# Altium project PCB_Project.PrjPcb
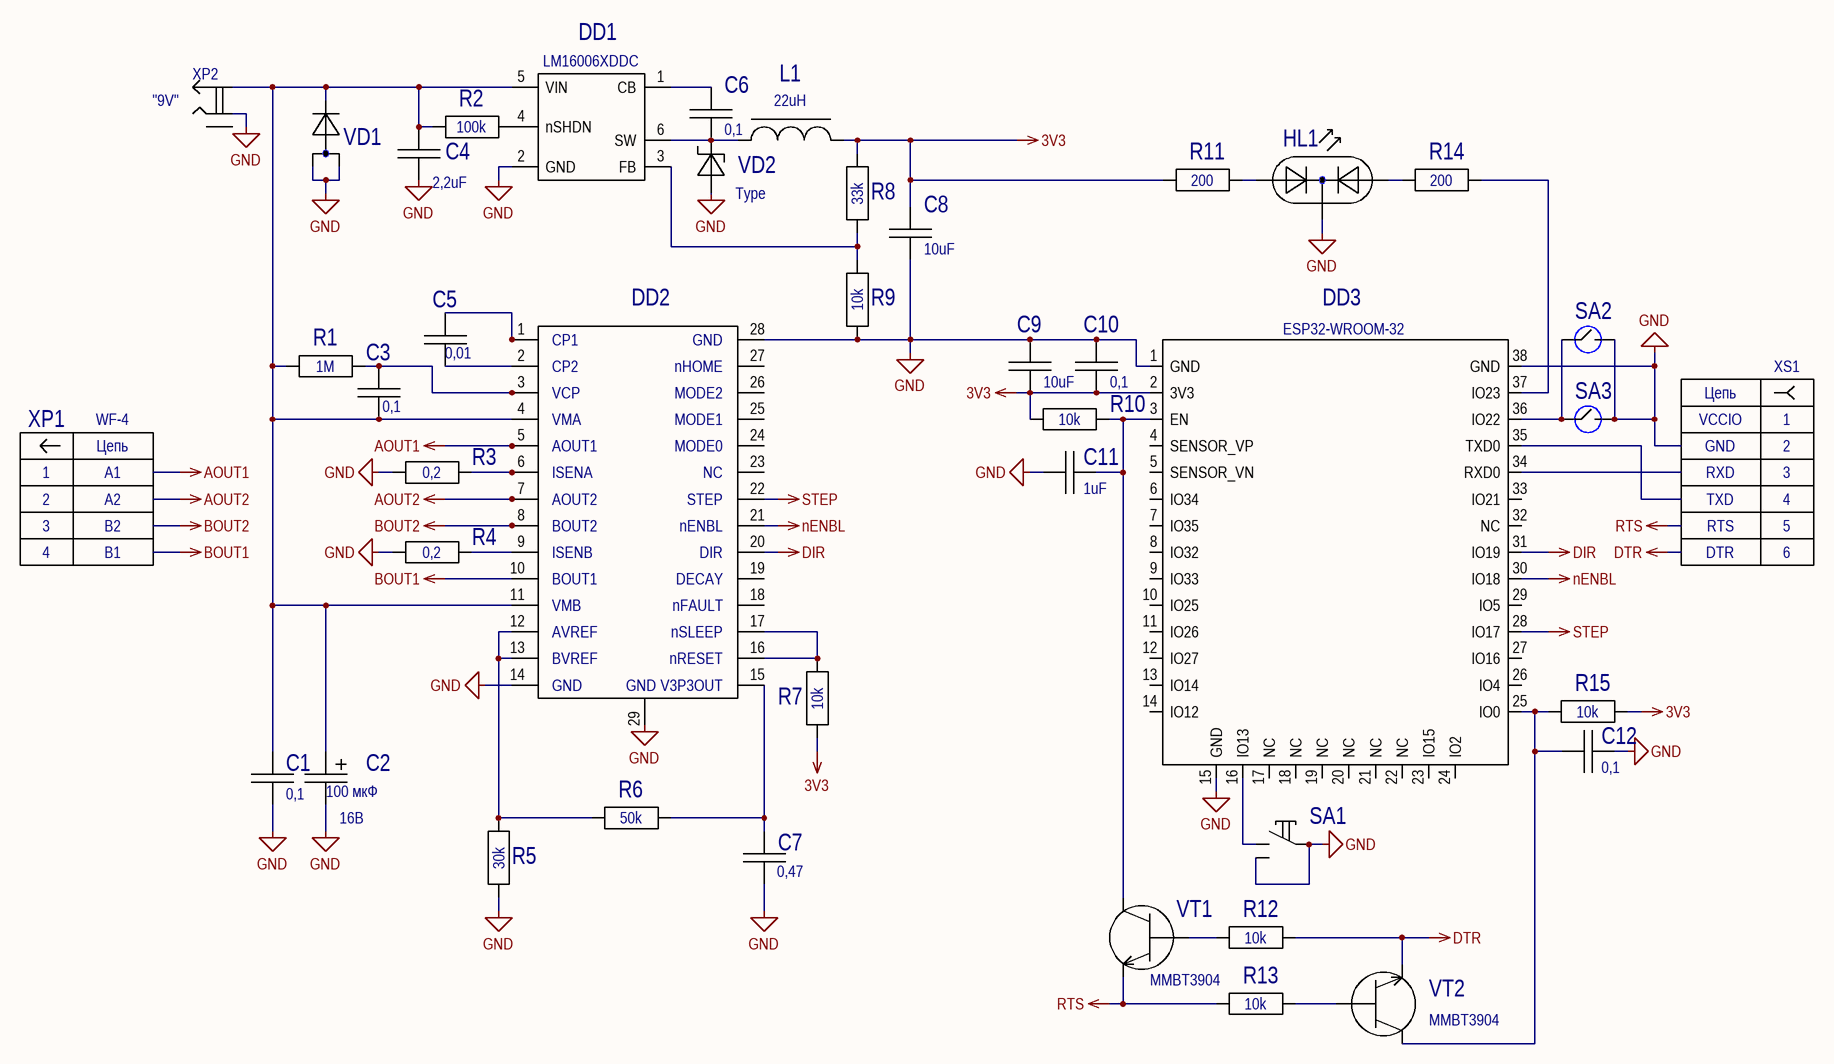
[diagram p0: Схема.SchDoc]
1 sheet, 42 parts. Net scope: global (net labels, ports and power ports of the same name join across sheets).
Board file: PCB.PcbDoc

## Sheet Схема.SchDoc: Индекс
size 419 x 296 mm; ApprovedBy: Утвердил; CheckedBy: Проверил; Author: Разработал; DrawnBy: Нормоконтроль; Engineer: Технолог; Address1: строка 1; Address2: строка 2; Address3: строка 3; Address4: строка 4; SheetNumber: 1; SheetTotal: 1

### Parts
C1  value 0,1  [CAPC1608X09N]  (hidden comment: C0603)
C2  value 100 мкФ  Volt: 16В  [K53-68-E]  (hidden comment: К53-68-E)
C3  value 0,1  [CAPC1608X09N]  (hidden comment: C0603)
C4  value 2,2uF  [CAPC2012X14N]  (hidden comment: C0805)
C5  value 0,01  [CAPC1608X09N]  (hidden comment: C0603)
C6  value 0,1  [CAPC1608X09N]  (hidden comment: C0603)
C7  value 0,47  [CAPC1608X09N]  (hidden comment: C0603)
C8  value 10uF  [CAPC2012X14N]  (hidden comment: C0805)
C9  value 10uF  [CAPC2012X14N]  (hidden comment: C0805)
C10  value 0,1  [CAPC1608X09N]  (hidden comment: C0603)
C11  value 1uF  [CAPC1608X09N]  (hidden comment: C0603)
C12  value 0,1  [CAPC1608X09N]  (hidden comment: C0603)
DD1  LM16006  [TSOP95P280X110-6N]  (value not drawn)
DD2  DRV8825  [TSOP65P640X120_HS-29N]  (value not drawn)
DD3  Твердотельное реле 90В, 10А  [ESP32]  (value not drawn)
HL1  LED3mm3pinCommonCatode  [LED3mm3pinCommonCatode]  (value not drawn)
L1  value 22uH  [INDP7373X45N]  (hidden comment: B82472G6223M000)
R1  value 1M  [RESC1608X06N]  (hidden comment: R0603)
R2  value 100k  [RESC1608X06N]  (hidden comment: R0603)
R3  value 0,2  [RESC2012X07N]  (hidden comment: CRL2512-FWR200ELF)
R4  value 0,2  [RESC2012X07N]  (hidden comment: CRL2512-FWR200ELF)
R5  value 30k  [RESC1608X06N]  (hidden comment: R0603)
R6  value 50k  [RESC1608X06N]  (hidden comment: R0603)
R7  value 10k  [RESC1608X06N]  (hidden comment: R0603)
R8  value 33k  [RESC1608X06N]  (hidden comment: R0603)
R9  value 10k  [RESC1608X06N]  (hidden comment: R0603)
R10  value 10k  [RESC1608X06N]  (hidden comment: R0603)
R11  value 200  [RESC1608X06N]  (hidden comment: R0603)
R12  value 10k  [RESC1608X06N]  (hidden comment: R0603)
R13  value 10k  [RESC1608X06N]  (hidden comment: R0603)
R14  value 200  [RESC1608X06N]  (hidden comment: R0603)
R15  value 10k  [RESC1608X06N]  (hidden comment: R0603)
SA1  Кнопка  [Кнопка 4,3х4,3 боковая]  (value not drawn)
SA2  геркон 12мм  [Геркон 12 мм]  (value not drawn)
SA3  геркон 12мм  [Геркон 12 мм]  (value not drawn)
VD1  SS10PH10  [TO-277A]  (value not drawn)
VD2  Диод Шоттки 40V, 500mA SOD123  [SODFL370X125-2N]  (value not drawn)
VT1  MMBT3904  [SOT95P245X110-3N]
VT2  MMBT3904  [SOT95P245X110-3N]
XP1  WF4  [WF-4]  (value not drawn)
XP2  DC-005  [DC-005]  (value not drawn)
XS1  PBS-6R  [PBS-6]  (value not drawn)

### Nets
3V3: C8.1 C9.2 C10.1 DD3.2(3V3) L1.1 R7.1 R8.2 R10.2 R11.2 R15.1
AOUT1: DD2.5 XP1.1
AOUT2: DD2.7 XP1.2
BOUT1: DD2.10 XP1.4
BOUT2: DD2.8 XP1.3
DIR: DD2.20 DD3.31(IO19)
DTR: R12.2 VT2.2(E) XS1.6
GND: C1.1 C2.2 C4.2 C7.2 C8.2 C9.1 C10.2 C11.1 C12.2 DD1.2(GND) DD2.14 DD2.28 DD2.29 DD3.1(GND) DD3.15(GND) DD3.38(GND) HL1.3(C) R3.1 R4.1 R5.1 R9.1 SA1.1 SA1.3 SA2.2 SA3.2 VD1.1(A1) VD1.2(A2) VD2.1 XP2.2 XS1.2
nENBL: DD2.21 DD3.30(IO18)
RTS: R13.1 VT1.2(E) XS1.5
STEP: DD2.22 DD3.28(IO17)
NetC1_2: C1.2 C2.1 C3.1 C4.1 DD1.5(VIN) DD2.4 DD2.11 R1.1 R2.1 VD1.3(C) XP2.1
NetC3_2: C3.2 DD2.3 R1.2
NetC5_1: C5.1 DD2.1
NetC5_2: C5.2 DD2.2
NetC6_1: C6.1 DD1.1(CB)
NetC6_2: C6.2 DD1.6(SW) L1.2 VD2.2
NetC7_1: C7.1 DD2.15 R6.2
NetC11_2: C11.2 DD3.3(EN) R10.1 VT1.3(C)
NetC12_1: C12.1 DD3.25(IO0) R15.2 VT2.3(C)
NetDD1_3: DD1.3(FB) R8.1 R9.2
NetDD1_4: DD1.4(nSHDN) R2.2
NetDD2_6: DD2.6 R3.2
NetDD2_9: DD2.9 R4.2
NetDD2_12: DD2.12 DD2.13 R5.2 R6.1
NetDD2_16: DD2.16 DD2.17 R7.2
NetDD3_16: DD3.16(IO13) SA1.2
NetDD3_34: DD3.34(RXD0) XS1.3
NetDD3_35: DD3.35(TXD0) XS1.4
NetDD3_36: DD3.36(IO22) SA2.1 SA3.1
NetDD3_37: DD3.37(IO23) R14.1
NetHL1_1: HL1.1(A1) R11.1
NetHL1_2: HL1.2(A2) R14.2
NetR12_1: R12.1 VT1.1(B)
NetR13_2: R13.2 VT2.1(B)

Not connected (* = marked no-connect by the designer): DD2 18(REFIN2+/AUN4+) 19 23 24 25 26 27; DD3 4(SENSOR_VP) 5(SENSOR_VN) 6(IO34) 7(IO35) 8(IO32) 9(IO33) 10(IO25) 11(IO26) 12(IO27) 13(IO14) 14(IO12) 17(NC) 18(NC) 19(NC) 20(NC) 21(NC) 22(NC) 23(IO15) 24(IO2) 26(IO4) 27(IO16) 29(IO5) 32(NC) 33(IO21); XP2 3; XS1 1

### Notes on the sheet
- (near XP2) "9V"
- (near XS1) VCCIO
- (near XS1) Цепь
- (near XP1) Цепь
- (near XP1) A1
- (near XS1) RXD
- (near XS1) GND
- (near XP1) A2
- (near XP1) B2
- (near XP1) B1
- (near XS1) TXD
- (near XS1) RTS
- (near XS1) DTR
- Перв. примен.
- Справ. №
- Подп. и дата
- Инв. № дубл.
- Взам. инв. №
- Изм.
- Лист
- № докум.
- Подп.
- Дата
- Лит.
- Масса
- Масштаб
- Разраб.
- Пров.
- Т.контр.
- Листов
- 1
- Инв. № подл.
- Н.контр.
- Утв.
- Копировал:
- Формат А3
- (in symbol DRV8825) CP1; GND; CP2; nHOME; VCP; MODE2; VMA; MODE1; AOUT1; MODE0; ISENA; NC; AOUT2; STEP; BOUT2; nENBL; ISENB; DIR; BOUT1; DECAY; VMB; nFAULT; AVREF; nSLEEP; BVREF; nRESET; V3P3OUT

### Library data of the parts
C1 C3 C6 C10 C12 = C0603: Part Number: Конденсатор 0.1мкФ X7R 50В 10% 0603, GRM188R71H104K; Group: Конденсаторы; Type: Type; TU: TU; Volt: Volt; TKE: TKE; Precision: Precision
C2 = К53-68-E: Group: Конденсаторы; Type: К53-68; TU: АЖЯР.673546.007 ТУ; Precision: ±20%; FullName: К53-68 "E"-16В-100мкФ±20%; TKE: TKE; Price: 1
C4 = C0805: Part Number: Конденсатор 2.2мкФ X7R 25В 0805, GRM21BR71E225K; Group: Конденсаторы; Type: Type; TU: TU; Volt: Volt; TKE: TKE; Precision: Precision
C5 = C0603: Part Number: Конденсатор 0.01 мкФ X7R 50В 10% 0603, GRM188R71H103K; Group: Конденсаторы; Type: Type; TU: TU; Volt: Volt; TKE: TKE; Precision: Precision
C7 = C0603: Part Number: Конденсатор CC0603KRX7R9BB474, 0603 X7R 0,47мкФ 50В 10%; Group: Конденсаторы; Type: Type; TU: TU; Volt: Volt; TKE: TKE; Precision: Precision
C8 C9 = C0805: Part Number: Конденсатор 10 мкФ X5R 10% 16В 0805, GRM21BR61C106K; Group: Конденсаторы; Type: Type; TU: TU; Volt: Volt; TKE: TKE; Precision: Precision
C11 = C0603: Part Number: Конденсатор 1мкФ X7R 10В 10% 0603, GRM188R61A105K; Group: Конденсаторы; Type: Type; TU: TU; Volt: Volt; TKE: TKE; Precision: Precision
DD1 = LM16006XDDC: LMR16006 SIMPLE SWITCHER® 60 V 0.6 A Buck Regulators; Part Number: Микросхема LM16006XDDC; Manufacturer: Texas Instruments; Group: Микросхемы; Type: LM16006XDDC; TU: TU; FullName: LM16006XDDC
DD2 = DRV8825: DRV8825 Stepper Motor Controller IC; Manufacturer: Texas Instruments; Group: Микросхемы; FullName: DRV8825PWP; Type: Type; TU: TU; Part Number: DRV8825PWP
DD3 = ESP32-WROOM-32: Модуль ESP32; Part Number: ESP32-WROOM-32D [16MB], Встраиваемый Wi-Fi/Bluetooth модуль на базе чипа ESP32-D0WD с PCB-антенной; Manufacturer: ESPRESSIV; Type: ESP32-WROOM-32
HL1 = LED3mm3pinCommonCatode: Part Number: Светодиод 3мм двухцветный с общим катодом; Group: Индикаторы единичные; Type: Type; TU: TU
L1 = B82472G6223M000: ЧИП-индуктивность силовая проволочная экранированная 22мкГн +20% 100кГц феррит 1.45А 91мОм; Part Number: Индуктивность 22uH, 1,45A B82472G6223M000; Group: Group; Type: Type; TU: TU; FullName: B82472G6223M000
R1 = R0603: Резистор 0603; Part Number: Резистор 0.1Вт 0603 1 МОм, 5%; Group: Резисторы; Type: Type; TU: TU
R2 = R0603: Резистор 0603; Part Number: Резистор 0.1Вт 0603 100 кОм, 5%; Group: Резисторы; Type: Type; TU: TU
R3 R4 = CRL2512-FWR200ELF: Резистор шунт BOURNS 1W 1% 200 мОм; Part Number: Резистор 0805 0,2 Ом, 1% RI0805LR200FT; Group: Резисторы; Type: Type; TU: TU; Precision: 1%
R5 = R0603: Резистор 0603; Part Number: Резистор 0.1Вт 0603 30 кОм, 1%; Group: Резисторы; Type: Type; TU: TU
R6 = R0603: Резистор 0603; Part Number: Резистор 0.1Вт 0603 50 кОм, 1%; Group: Резисторы; Type: Type; TU: TU
R7 R10 R12 R13 R15 = R0603: Резистор 0603; Part Number: Резистор 0.1Вт 0603 10 кОм, 5%; Group: Резисторы; Type: Type; TU: TU
R8 = R0603: Резистор 0603; Part Number: Резистор 0.1Вт 0603 33 кОм, 1%; Group: Резисторы; Type: Type; TU: TU
R9 = R0603: Резистор 0603; Part Number: Резистор 0.1Вт 0603 10 кОм, 1%; Group: Резисторы; Type: Type; TU: TU
R11 R14 = R0603: Резистор 0603; Part Number: Резистор 0.1Вт 0603 200 Ом, 5%; Group: Резисторы; Type: Type; TU: TU
SA1 = TactSwitch4.5x4.5: Кнопка трехконтактная 4,5х4,5 боковая; Part Number: tact switch 4.5x4.5mm; Group: Кнопки; Type: Type; TU: TU
SA2 SA3 = геркон 12мм: Геркон пластик Китай 12мм; Group: Изделия коммутационные; Type: Type; TU: TU; Part Number: Геркон 12 мм
VD1 = SS10PH10: High Current Density Surface-Mount / High Voltage Schottky Rectifiers; Group: Диоды; Type: Type; TU: TU; Part Number: SS10PH10
VD2 = MBR0540: Group: Диоды; Type: Type; TU: TU; Part Number: MBR0540
VT1 VT2 = MMBT3904: MMBT3904, Транзистор NPN 40В 0.2А [SOT-23-3]; Part Number: Транзистор MMBT3904; Group: Транзисторы; Type: MMBT3904; TU: TU; FullName: MMBT3904
XP1 = WF4_1: Вилка 2,54мм прямая на плату; Part Number: Вилка WF-4; Group: Соединители; Manufacture: Manufacture; Type: WF-4
XP2 = DC-005: Разъем питания DC 2.1x5.5 мм гнездо, прямой угол на плату; Part Number: Вилка DS-201; Group: Соединители; Manufacture: Manufacture; Type: DS-201
XS1 = PBS-6: Розетка 2,54мм прямая однорядная на плату; Part Number: Розетка PBS-6; Group: Соединители; Manufacture: Manufacture; Type: PBS-6